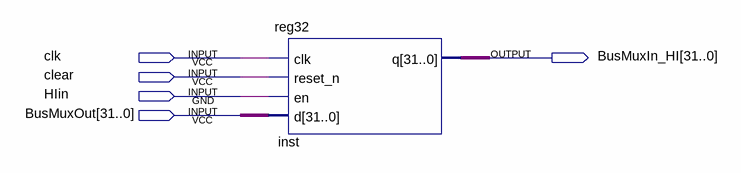
[diagram p0: schematic sheet]
// Quartus schematic hi_design.bdf as structural Verilog: 1 symbols, 5 pins
module hi_design (
  input  clk,
  input  clear,
  input  HIin,
  input  [31:0] BusMuxOut,
  output [31:0] BusMuxIn_HI
);

  reg32 inst (.clk(clk), .reset_n(clear), .en(HIin), .d(BusMuxOut), .q(BusMuxIn_HI));
endmodule
